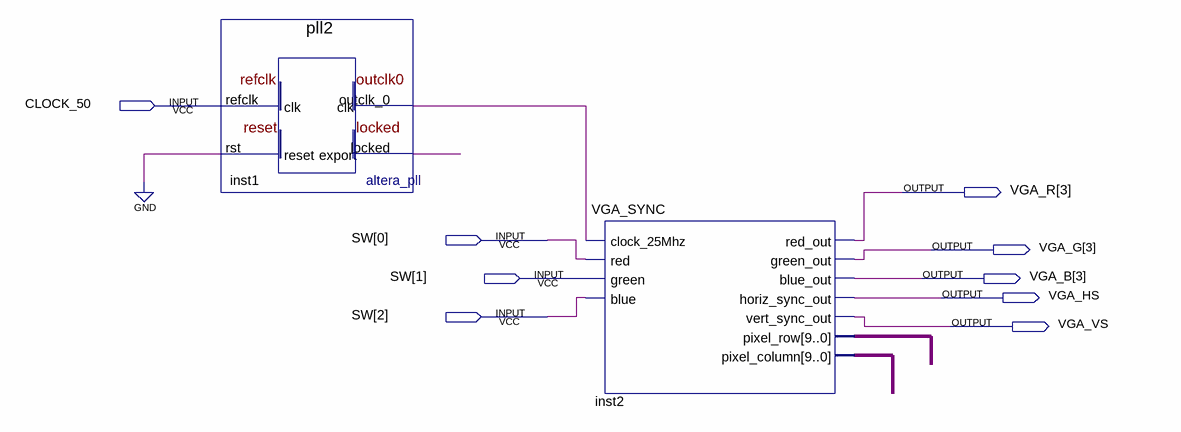
[diagram p0: schematic sheet]
// Quartus schematic toplevel.bdf as structural Verilog: 2 symbols, 9 pins
module toplevel (
  input  CLOCK_50,
  input  [2:0] SW,
  output [3:3] VGA_R,
  output [3:3] VGA_G,
  output [3:3] VGA_B,
  output VGA_HS,
  output VGA_VS
);

  wire inst1_locked, inst1_outclk_0;
  wire [9:0] inst2_pixel_column, inst2_pixel_row;

  pll2 inst1 (.refclk(CLOCK_50), .rst(1'b0), .outclk_0(inst1_outclk_0), .locked(inst1_locked));
  VGA_SYNC inst2 (
    .clock_25Mhz(inst1_outclk_0), .red(SW[0]), .green(SW[1]), .blue(SW[2]), .red_out(VGA_R[3]),
    .green_out(VGA_G[3]), .blue_out(VGA_B[3]), .horiz_sync_out(VGA_HS), .vert_sync_out(VGA_VS),
    .pixel_row(inst2_pixel_row), .pixel_column(inst2_pixel_column));
endmodule
